# EAGLE design newswarm (EAGLE 9.6.2)
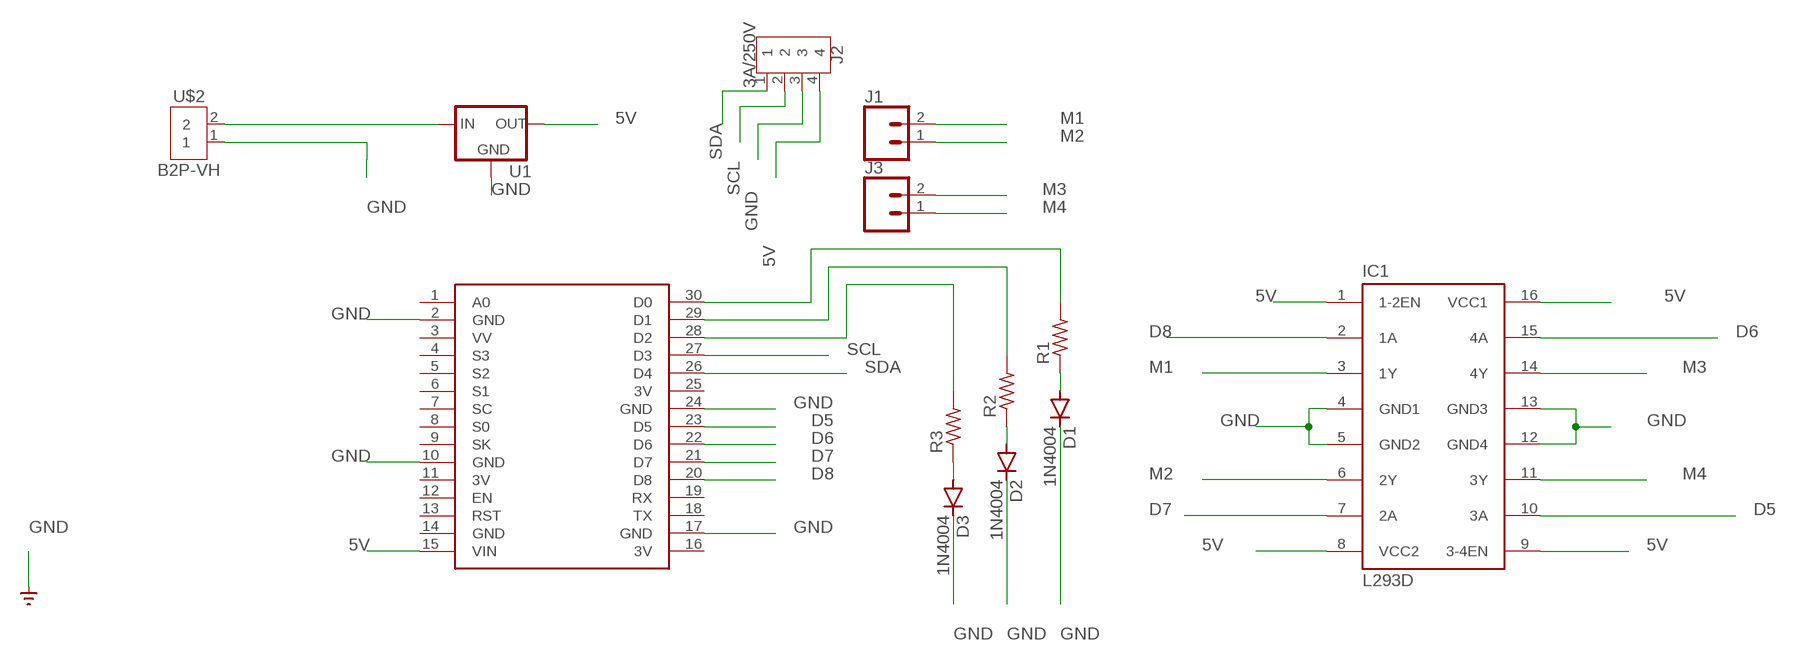
[diagram p0: schematic, sheet 1]

## Parts
D1  1N4004  [DO41-10]
D2  1N4004  [DO41-10]
D3  1N4004  [DO41-10]
IC1  L293D  [DIL16]
J1  CONN_02  [1X02]
J2  3A/250V  B4B-XH-A  [B4B-XH-A]
J3  CONN_02  [1X02]
R1  R-US_0207/10  [0207/10]
R2  R-US_0207/10  [0207/10]
R3  R-US_0207/10  [0207/10]
U1  V_REG_78XXSIDE  [78XXL]
U$1  NODEMCU  [NODEMCU]
U$2  B2P-VH  [B2P-VH_396-2N]

## Nets
5V: IC1.1(1-2EN) IC1.8(VCC2) IC1.9(3-4EN) IC1.16(VCC1) J2.4 U1.OUT U$1.15(VIN)
D5: IC1.10(3A) U$1.23(D5)
D6: IC1.15(4A) U$1.22(D6)
D7: IC1.7(2A) U$1.21(D7)
D8: IC1.2(1A) U$1.20(D8)
GND: D1.C D2.C D3.C IC1.4(GND1) IC1.5(GND2) IC1.12(GND4) IC1.13(GND3) J2.3 U1.GND U$1.2(GND) U$1.10(GND) U$1.17(GND) U$1.24(GND) U$2.1 ; supply symbol labelled SUPPLY_BRASTAN_GND_
M1: IC1.3(1Y) J1.2
M2: IC1.6(2Y) J1.1
M3: IC1.14(4Y) J3.2
M4: IC1.11(3Y) J3.1
N$1: R1.2 U$1.30(D0)
N$2: D1.A R1.1
N$3: U1.IN U$2.2
N$4: R2.2 U$1.29(D1)
N$5: R3.2 U$1.28(D2)
N$6: D3.A R3.1
N$7: D2.A R2.1
SCL: J2.2 U$1.27(D3)
SDA: J2.1 U$1.26(D4)
Unconnected: U$1.1(A0) U$1.3(VV) U$1.4(S3) U$1.5(S2) U$1.6(S1) U$1.7(SC) U$1.8(S0) U$1.9(SK) U$1.12(EN) U$1.13(RST) U$1.18(TX) U$1.19(RX)

## Power pins joined to a net without a drawn wire
3V: U$1.11(3V) U$1.16(3V) U$1.25(3V)
GND: U$1.14(GND)

## Library data of the parts
D1-D3 = diode:1N4004: DIODE general purpose rectifier, 1 A
IC1 = st-microelectronics:L293D: PUSH-PULL 4 CHANNEL DRIVER; MPN: L293D; OC_FARNELL: 9589619; OC_NEWARK: 56P8249
J1 J3 = SparkFun-Connectors:CONN_02: Multi connection point. Often used as Generic Header-pin footprint for 0.1 inch spaced/style header connections On any of the 0.1 inch spaced packages, you can populate with these: Break Away Headers - Straight <https://www.sparkfun.com/products/116> (PRT-00116) Break Away Male Headers - Right Angle <https://www.sparkfun.com/products/553> (PRT-00553) Female Headers <https://www.sparkfun.com/products/115> (PRT-00115) Break Away Headers - Machine Pin <https://www.sparkfun.com/products/117> (PRT-00117) Break Away Female Headers - Swiss Machine Pin <https://www.sparkfun.com/products/743> (PRT-00743) For SCREWTERMINALS and SPRING TERMINALS visit here: Screw Terimnals on SparkFun.com <https://www.sparkfun.com/search/results?term=Screw+Terminals> (5mm/3.5mm/2.54mm spacing) This device is also useful as a general connection point to wire up your design to another part of your project. Our various solder wires solder well into these plated through hole pads. Hook-Up Wire - Assortment (Stranded, 22 AWG) <https://www.sparkfun.com/products/11375> (PRT-11375) Hook-Up Wire - Assortment (Solid Core, 22 AWG) <https://www.sparkfun.com/products/11367> (PRT-11367) View the entire wire category on our website here <https://www.sparkfun.com/categories/141> Special notes: Molex polarized connector foot print use with: PRT-08233 with associated crimp pins and housings. 2.54_SCREWTERM for use with PRT-10571. 3.5mm Screw Terminal footprints for PRT-08084 5mm Screw Terminal footprints for use with PRT-08432
J2 = Connector:B4B-XH-A: XH Connector Top Entry - 4POS Details see: Datasheet <http://www.jst-mfg.com/product/pdf/eng/eXH.pdf>; CATEGORY: CONNECTOR; DSECRIPTION: 2.5mm pitch/disconnctable crimp style connector; MANUFACTURER: JST (XH connector); MPN: B4B-XH-A; OPERATING_TEMPERATURE: -25 C to 85 C; PART_STATUS: ACTIVE; ROHS_COMPLIANT: COMPLAINT; SERIES: B4B-XH-A; SUB_CATEGORY: Through hole; TYPE: TOP ENTRY
R1-R3 = BeagleBone_Black_Wireless:R-US_: RESISTOR, American symbol
U1 = SparkFun-IC-Power:V_REG_78XX: Voltage Regulator Standard 78xx regulator. IGO (Input Ground Output). Spark Fun Electronics SKU : COM-00107
U$1 = nodemcu:NODEMCU
U$2 = Connector:B2P-VH: VH Connector Top Entry - 2POS, 3.96MM Details see: Datasheet <http://www.jst-mfg.com/product/pdf/eng/eVH.pdf>; CATEGORY: Connector; DESCRIPTION: CONN HEADER VERT 2POS 3.96MM; MANUFACTURER: JST Sales America Inc.; MPN: B2P-VH; OPERATING_TEMPERATURE: -25°C ~ 85°C; PART_STATUS: Active; ROHS_COMPLIANCE: RoHS2 Compliant; SERIES: VH; TYPE: Top Entry

## Board
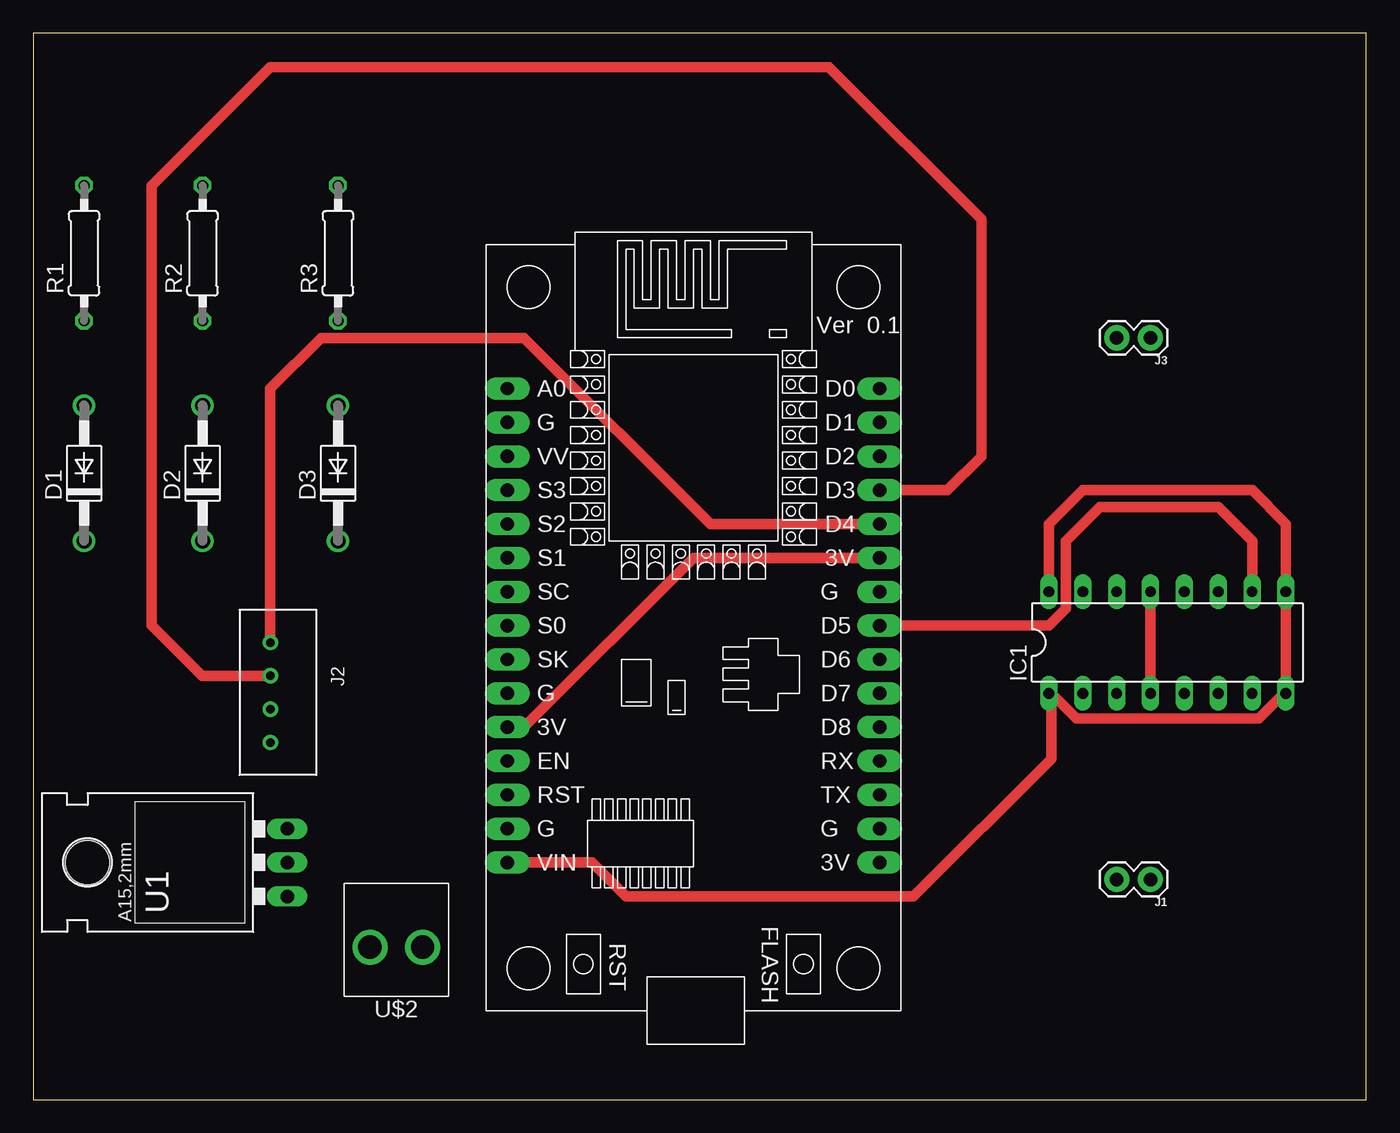
[diagram p1: board, top side]
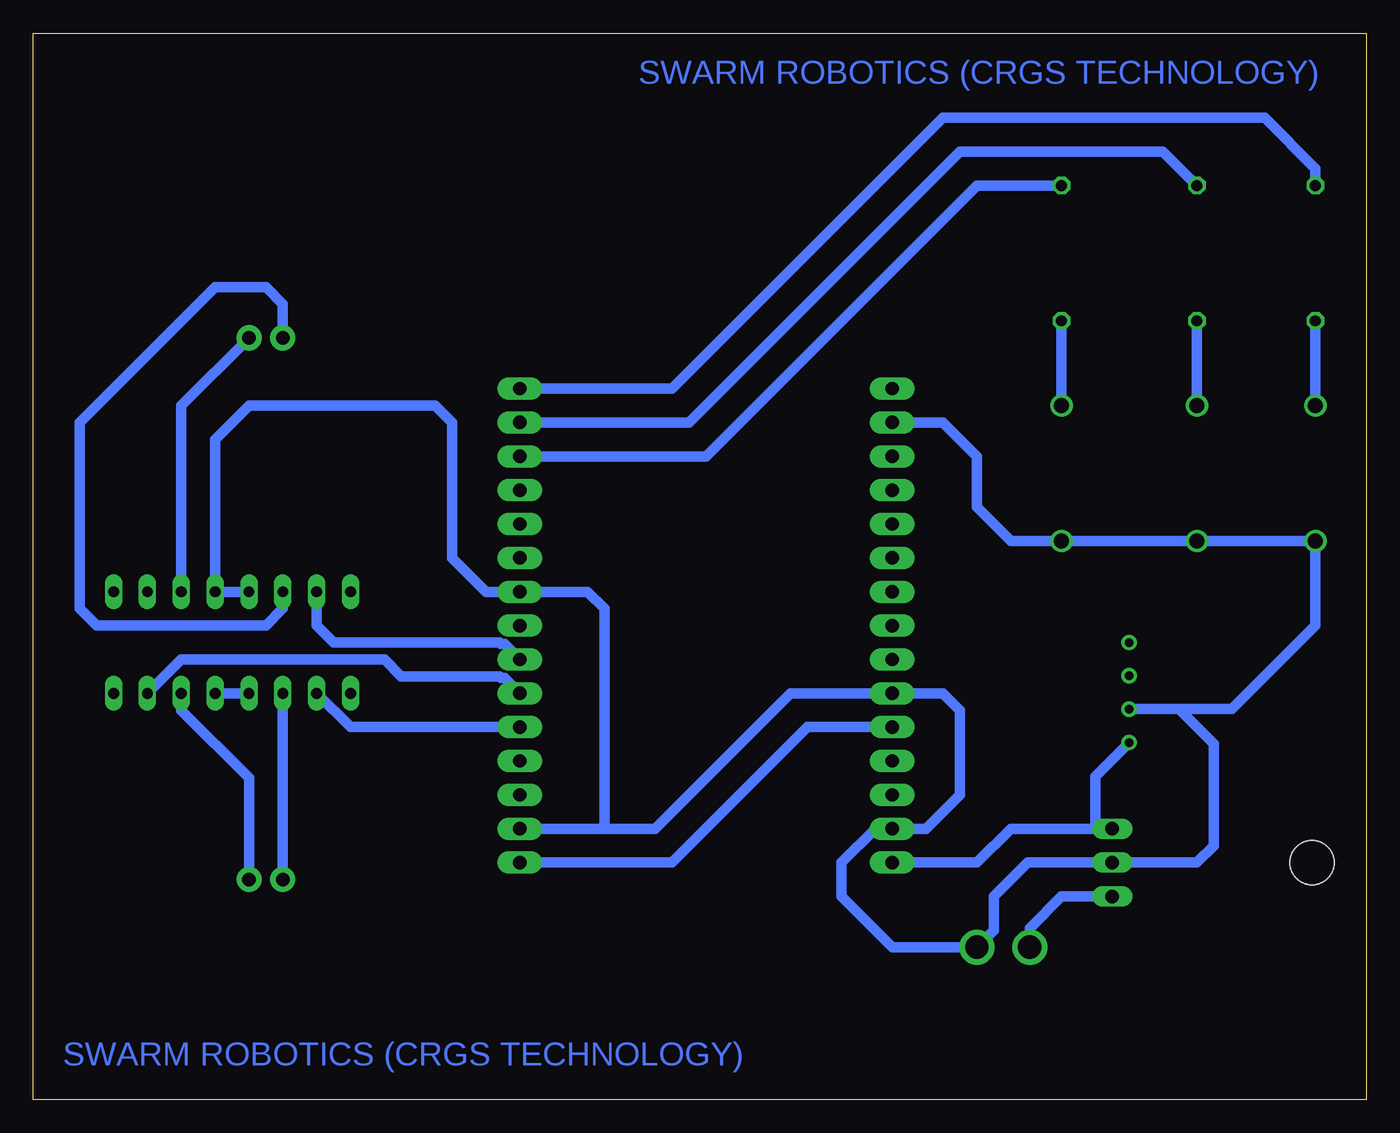
[diagram p2: board, bottom side, seen from below]

Size 100 x 80 mm. Coordinates in mm from the lower left corner, seen from the top.
Outline: 0,0 100,0 100,80 0,80 0,0
Copper layers (1*16): Top 0.035mm / dielectric 1.5mm / Bottom 0.035mm
Design rules "default": minimum track width 6mil, minimum drill 0.35mm, track to track 6mil, track to pad 6mil, pad to pad 6mil, via to via 6mil, smd to smd 6mil, copper to edge 40mil, drill to drill 6mil, minimum pad ring 10mil, minimum via ring 8mil, stop-mask expansion 4mil, vias tented up to drill 0mil, thermal gap 10mil

### Footprints (pad centres in the part's own frame; a part is rotated, then mirrored left to right if it is on the bottom)
DO41-10 = drill 1.118: A 5.08,0; C -5.08,0
DIL16 = drill 0.813 long: 1 -8.89,-3.81; 2 -6.35,-3.81; 3 -3.81,-3.81; 4 -1.27,-3.81; 5 1.27,-3.81; 6 3.81,-3.81; 7 6.35,-3.81; 8 8.89,-3.81; 9 8.89,3.81; 10 6.35,3.81; 11 3.81,3.81; 12 1.27,3.81; 13 -1.27,3.81; 14 -3.81,3.81; 15 -6.35,3.81; 16 -8.89,3.81
1X02 = drill 1.016 pad 1.88: 1 0,0; 2 2.54,0
B4B-XH-A = drill 0.64: 1 0,0; 2 2.5,0; 3 5,0; 4 7.5,0
0207/10 = drill 0.813 octagon: 1 -5.08,0; 2 5.08,0
78XXL = drill 1.016 long: GND 0,-3.81; IN -2.54,-3.81; OUT 2.54,-3.81 | hole 3.302: 0,11.176
NODEMCU = drill 1 pad 1.676 long: 1 -13.97,17.78; 2 -13.97,15.24; 3 -13.97,12.7; 4 -13.97,10.16; 5 -13.97,7.62; 6 -13.97,5.08; 7 -13.97,2.54; 8 -13.97,0; 9 -13.97,-2.54; 10 -13.97,-5.08; 11 -13.97,-7.62; 12 -13.97,-10.16; 13 -13.97,-12.7; 14 -13.97,-15.24; 15 -13.97,-17.78; 16 13.97,-17.78; 17 13.97,-15.24; 18 13.97,-12.7; 19 13.97,-10.16; 20 13.97,-7.62; 21 13.97,-5.08; 22 13.97,-2.54; 23 13.97,0; 24 13.97,2.54; 25 13.97,5.08; 26 13.97,7.62; 27 13.97,10.16; 28 13.97,12.7; 29 13.97,15.24; 30 13.97,17.78
B2P-VH_396-2N = drill 1.75: 1 0,0; 2 3.96,0

### Placement (x,y rotation side)
D1  3.81,46.99 90 top
D2  12.7,46.99 90 top
D3  22.86,46.99 90 top
IC1  85.09,34.29 0 top
J1  83.82,16.51 180 top
J2  17.78,34.29 270 top
J3  83.82,57.15 180 top
R1  3.81,63.5 90 top
R2  12.7,63.5 90 top
R3  22.86,63.5 90 top
U1  15.24,17.78 90 top
U$1  49.53,35.56 0 top
U$2  29.21,11.43 180 top

### Tracks (layer width: path | path; a pad name or v marks a point on that pad's centre or on a via)
3V
  Top 0.8: U$1.11 36.83,27.94 49.53,40.64 U$1.25
  Bottom 0.8: U$1.16 52.07,17.78 41.91,27.94 U$1.11
5V
  Top 0.8: IC1.16 76.2,43.18 78.74,45.72 91.44,45.72 93.98,43.18 IC1.9 IC1.8 93.82,30.48 91.94,28.61 78.24,28.61 76.36,30.48 | 76.36,30.48 IC1.1 | U$1.15 41.91,17.78 44.45,15.24 66.04,15.24 76.36,25.56 76.36,30.48
  Bottom 0.8: U$1.15 29.21,17.78 26.67,20.32 20.32,20.32 | U1.OUT 20.32,20.32 | J2.4 20.32,24.25 20.32,20.32
D5
  Top 0.8: IC1.10 91.44,41.91 88.9,44.45 80.01,44.45 77.47,41.91 77.47,36.83 76.2,35.56 U$1.23
D6
  Bottom 0.8: U$1.22 64.65,34.17 64.91,34.17 65.03,34.29 77.47,34.29 78.74,35.56 IC1.15
D7
  Bottom 0.8: U$1.21 64.65,31.63 64.91,31.63 65.03,31.75 72.39,31.75 73.66,33.02 88.9,33.02 IC1.7
D8
  Bottom 0.8: IC1.2 76.2,27.94 U$1.20
GND
  Top 0.8: IC1.13 IC1.4
  Bottom 0.8: 14.05,29.29 J2.3 | 14.05,29.29 11.43,26.67 11.43,19.05 12.7,17.78 U1.GND 25.4,17.78 27.94,15.24 27.94,12.7 U$2.1 35.56,11.43 39.37,15.24 39.37,17.78 36.83,20.32 U$1.14 33.02,20.32 30.48,22.86 30.48,29.21 31.75,30.48 U$1.10 43.18,30.48 53.34,20.32 57.15,20.32 | U$1.2 31.75,50.8 29.21,48.26 29.21,44.45 26.67,41.91 D3.C D2.C D1.C 3.81,35.56 10.08,29.29 14.05,29.29 | 57.15,20.32 U$1.17 | 57.15,20.32 57.15,36.83 58.42,38.1 U$1.24 66.04,38.1 68.58,40.64 68.58,50.8 69.85,52.07 83.82,52.07 86.36,49.53 IC1.12 IC1.13 | IC1.4 IC1.5
M1
  Bottom 0.8: IC1.3 J1.2
M2
  Bottom 0.8: IC1.6 88.9,29.21 83.82,24.13 J1.1
M3
  Bottom 0.8: J3.2 81.28,59.69 82.55,60.96 86.36,60.96 96.52,50.8 96.52,36.83 95.25,35.56 82.55,35.56 81.28,36.83 IC1.14
M4
  Bottom 0.8: J3.1 88.9,52.07 IC1.11
N$1
  Bottom 0.8: R1.2 3.81,69.85 7.62,73.66 31.75,73.66 52.07,53.34 U$1.30
N$2
  Bottom 0.8: R1.1 D1.A
N$3
  Bottom 0.8: U1.IN 22.86,15.24 25.25,12.85 U$2.2
N$4
  Bottom 0.8: R2.2 15.24,71.12 30.48,71.12 50.8,50.8 U$1.29
N$5
  Bottom 0.8: R3.2 29.21,68.58 49.53,48.26 U$1.28
N$6
  Bottom 0.8: R3.1 D3.A
N$7
  Bottom 0.8: R2.1 D2.A
SCL
  Top 0.8: J2.2 12.66,31.79 8.89,35.56 8.89,68.58 17.78,77.47 59.69,77.47 71.12,66.04 71.12,48.26 68.58,45.72 U$1.27
SDA
  Top 0.8: U$1.26 50.8,43.18 36.83,57.15 21.59,57.15 17.78,53.34 J2.1

### Text on the board
Bottom: SWARM ROBOTICS (CRGS TECHNOLOGY) | SWARM ROBOTICS (CRGS TECHNOLOGY)